# EasyEDA Pro project AC2024-欧标单相v1.2（使用立创EDA专业版）.epro, board AC2024-02
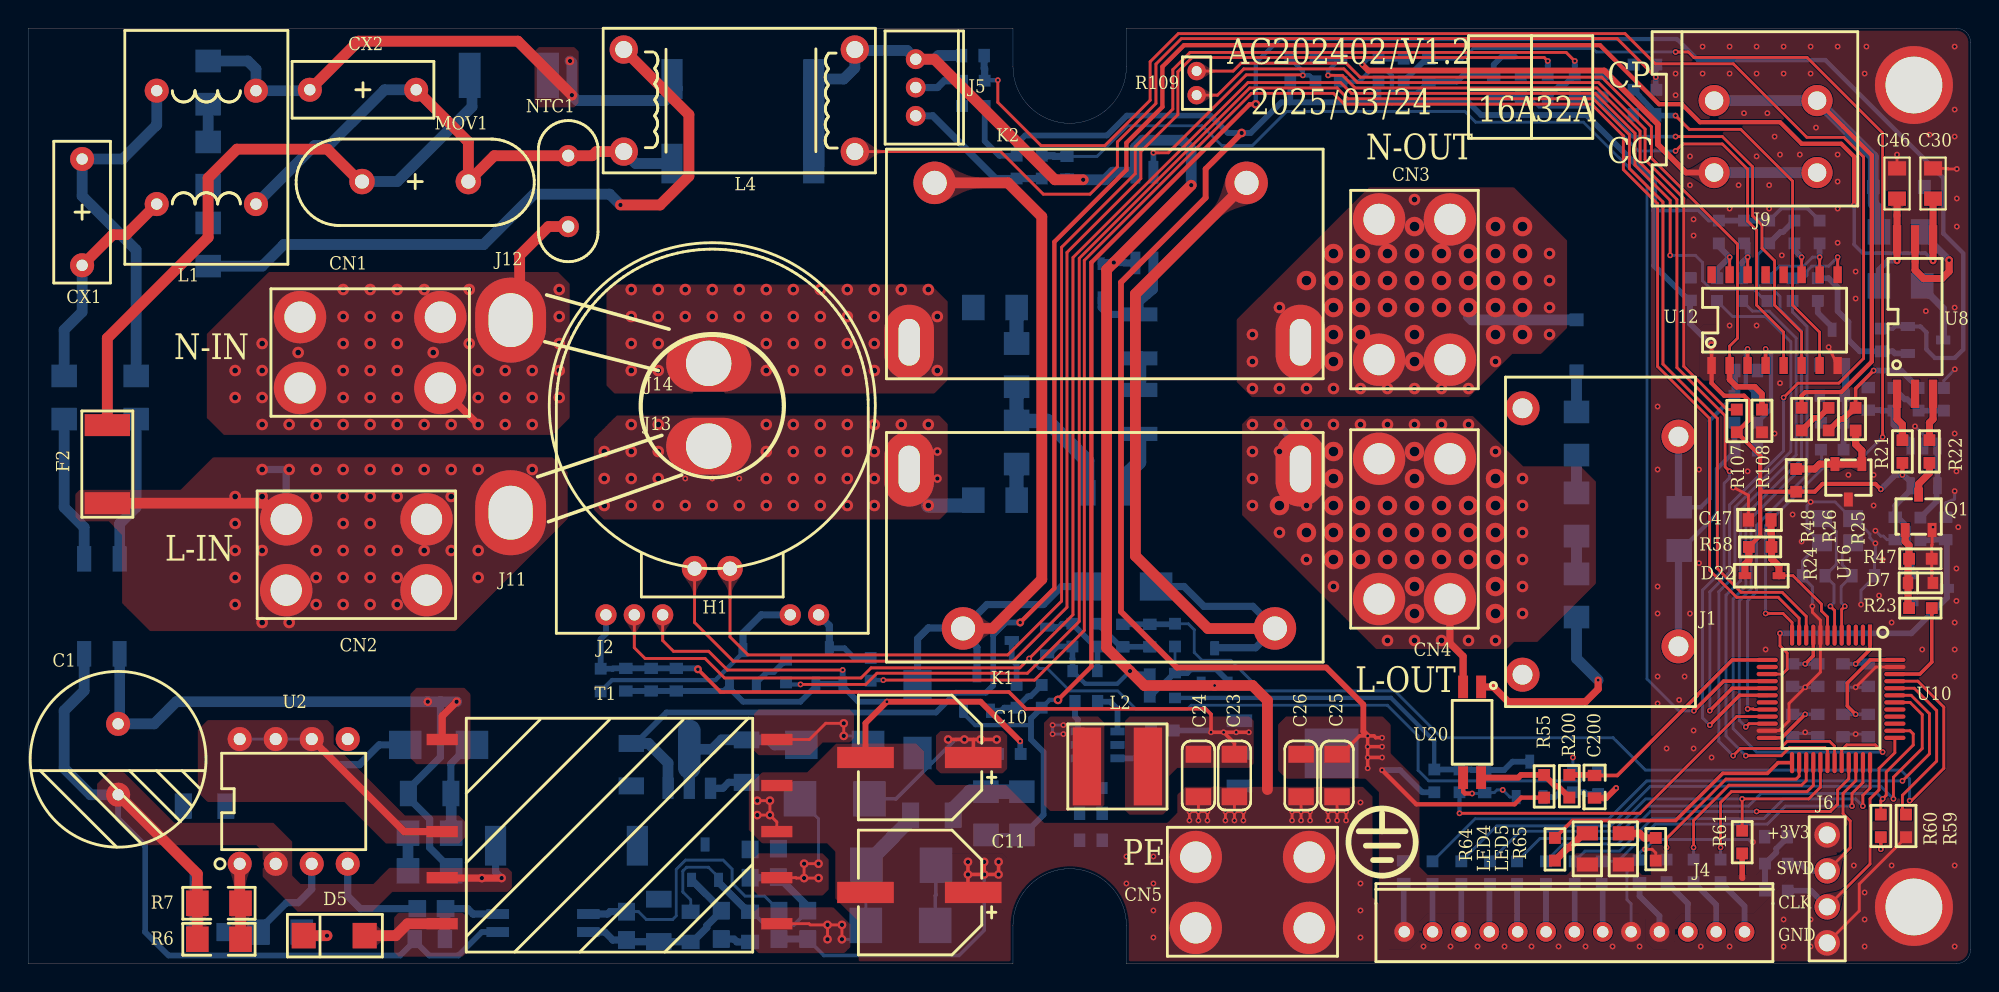
[diagram p7: board, top side]
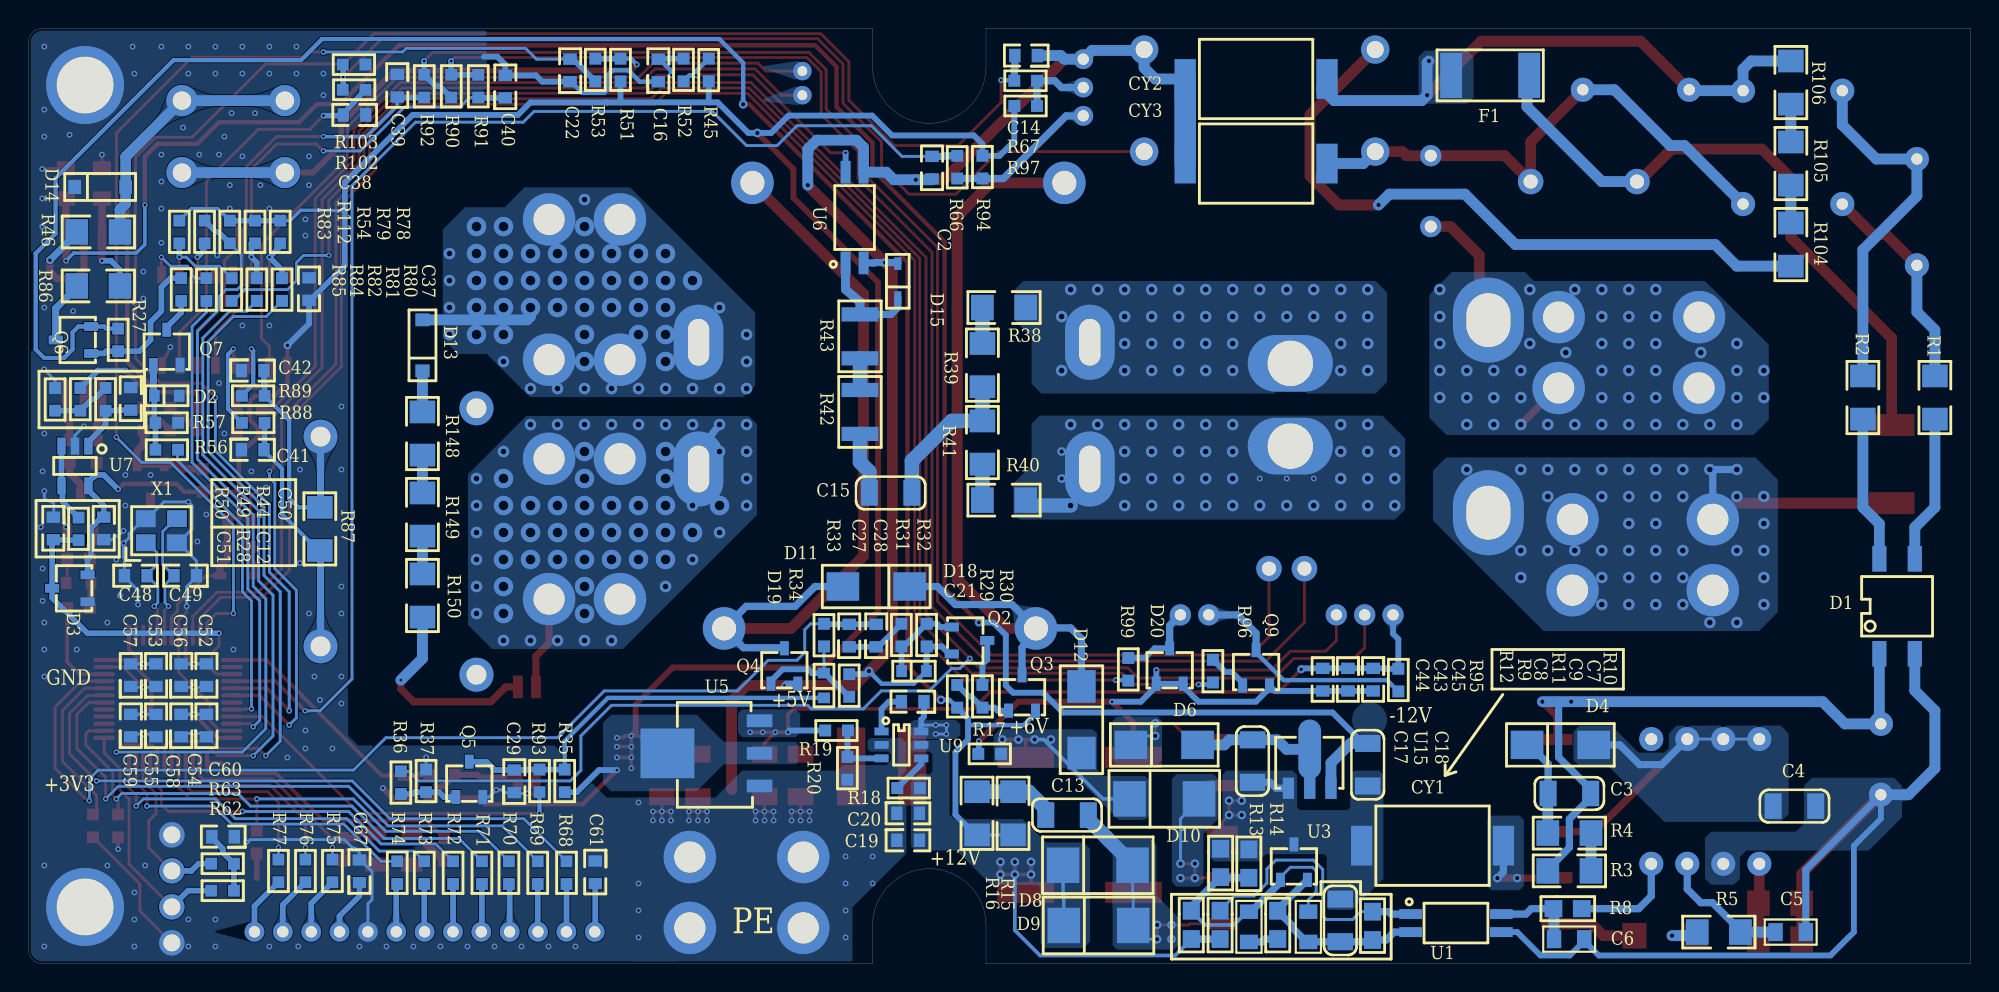
[diagram p8: board, bottom side, seen from below]

Outline 137 x 66 mm; copper layers: Top Layer, Bottom Layer. Coordinates in mm from the lower left corner of the outline.
Outline path: 0,66 0,0 69.45,0 69.45,2.7 arc(73.45,6.7) 77.45,2.7 77.45,0 136,0 arc(136.71,0.29) 137,1 137,65 arc(136.71,65.71) 136,66 77.45,66 77.45,63.3 arc(73.45,59.3) 69.45,63.3 69.45,66 0,66
Stack: Top Layer 0.0343mm / SUBSTRATE1 0.254mm er 4.3 / Bottom Layer 0.0343mm

## Design rules (mm)
spacing safeClearance (default): track to track 0.152, other pairs 0 to 0.254
spacing safeClearance1: track to track 2, other pairs 0 to 2
spacing safeClearance2: track to track 0.152, other pairs 0 to 0.152
spacing safeClearance3: track to track 0.254, other pairs 0 to 0.254
spacing safeClearance4: track to track 0.203, other pairs 0 to 0.254
track width trackWidth (default): min 0.152, default 0.203, max 5.08
track width trackWidth1: min 0.152, default 0.762, max 5.08
track width trackWidth2: min 0.152, default 0.508, max 5.08
track width trackWidth3: min 0.152, default 0.203, max 5.08
track width trackWidth4: min 0.152, default 0.254, max 5.08
differential pair differentialPair (default): width min 0.127, default 0.254, max 2.54; gap min 0.152, default 0.152
via viaSize (default): diameter min 0.5, default 0.61, max 10; hole min 0.3, default 0.305, max 6
net $$$23265 uses POR99140385
net +5V uses POR76334615
net $$$29133 uses POR74324617
net $$$25465 uses POR80075074
net +12V uses POR82536484
net +6V uses POR68774254
net AGND uses POR24477767
net $$$24219 uses POR72453578
net $$$6271 uses POR17870074
net $$$22503 uses POR37894306
net GND uses POR43455361
net +3V3 uses POR19795428
net L-IN2 uses POR56450083
net V+ uses POR25423456
net $$$22081 uses POR48997329
net $$$23262 uses POR41571345
net $$$12226 uses POR1077142
net -12V uses POR34067652
net N-OUT uses POR80925143
net $$$17797 uses POR43819538
net L-IN uses POR98761007
net $$$17793 uses POR41183665
net N-IN uses POR41419589
net L-OUT uses POR66909326
pour ie6310 uses POR77305320
pour ie6311 uses POR99140385
pour ie6312 uses POR42237262
pour ie6313 uses POR76334615
pour ie6314 uses POR23441365
pour ie6315 uses POR74324617
pour ie6316 uses POR28344334
pour ie6317 uses POR65403304
pour ie6318 uses POR77011558
pour ie6319 uses POR80075074
pour ie6320 uses POR77717735
pour ie6321 uses POR60842042
pour ie6322 uses POR30590647
pour ie6323 uses POR86555992
pour ie6324 uses POR82536484
pour ie6325 uses POR26768632
pour ie6326 uses POR75794220
pour ie6327 uses POR29333259
pour ie6328 uses POR54887547
pour ie6329 uses POR81080349
pour ie6330 uses POR83404065
pour ie6331 uses POR57536527
pour ie6332 uses POR56450083
pour ie6333 uses POR47109665
pour ie6334 uses POR43455361
pour ie6335 uses POR91392147
pour ie6336 uses POR24477767
pour ie6337 uses POR68774254
pour ie6338 uses POR69109533
pour ie6339 uses POR19795428
pour ie6340 uses POR25423456
pour ie6341 uses POR48997329
pour ie6342 uses POR37894306
pour ie6343 uses POR17870074
pour ie6344 uses POR72453578
pour ie6345 uses POR41571345
pour ie6346 uses POR1077142
pour ie6347 uses POR34067652
pour ie6348 uses POR49352428
pour ie6349 uses POR96451461
pour ie6350 uses POR65814
pour ie6351 uses POR78819734
pour ie6352 uses POR20858150
pour ie6353 uses POR41183665
pour ie6354 uses POR43819538
pour ie6355 uses POR98761007
pour ie6356 uses POR41419589
pour ie6357 uses POR80925143
pour ie6358 uses POR36935016
pour ie6359 uses POR66909326

## Placement (name value [footprint] x y rotation side)
C1  CAP-AE4  [C-P-5MM]  6.33 14.42 270 top
C2  100nF/25V/0603  [C0603]  73.26 56.97 270 bottom
C3  15pF/1kV/1206  [C1206]  28.3 12.01 180 bottom
C4  15pF/1kV/1206  [C1206]  12.43 11.12 0 bottom
C5  10uF/50V/0805  [C0805]  12.68 2.23 180 bottom
C6  1.5nF/50V/0805/NC  [C0805]  28.31 1.73 180 bottom
C7  1nF/2kV/1206  [C1206]  44.46 3.05 270 bottom
C8  100nF/50V/0805  [C0805]  50.91 2.61 90 bottom
C9  330pF/50V/0805  [C0805]  46.72 2.61 90 bottom
C10  470uF/16V  [SMD-C-D8XL10.5MM]  62.85 14.55 180 top
C11  330uF/25V  [SMD-C-D8XL10.5MM]  62.85 5.02 180 top
C12  100nF/25V/0603  [C0603]  131.68 29.92 90 bottom
C13  1nF/2kV/1206  [C1206]  63.74 10.48 180 bottom
C14  100nF/25V/0603  [C0603]  67.42 64.08 180 bottom
C15  15pF/1kV/1206  [C1206]  76.18 33.22 0 bottom
C16  100PF/25V/0603/NC  [C0603]  92.56 63.82 270 bottom
C17  10uF/50V/1206  [C1206]  50.65 14.29 90 bottom
C18  10uF/50V/1206  [C1206]  42.53 14.04 90 bottom
C19  10uF/25V/0603  [C0603]  74.15 8.71 0 bottom
C20  100nF/25V/0603  [C0603]  74.15 10.61 0 bottom
C21  100nF/25V/0603  [C0603]  75.42 18.49 180 bottom
C22  10nF/25V/0603  [C0603]  98.79 63.82 270 bottom
C23  47uF/10V/1206  [C1206]  85.07 13.28 90 top
C24  47uF/10V/1206  [C1206]  82.53 13.28 90 top
C25  47uF/10V/1206  [C1206]  92.31 13.28 90 top
C26  47uF/10V/1206  [C1206]  89.77 13.28 90 top
C27  4.7uF/25V/0603  [C0603]  79.1 23.95 270 bottom
C28  4.7uF/25V/0603  [C0603]  77.2 23.95 270 bottom
C29  100nF/25V/0603  [C0603]  102.72 13.66 270 bottom
C30  10uF/25V/0805  [C0805]  134.35 55.06 90 top
C37  100nF/25V/0603  [C0603]  117.2 46.81 90 bottom
C38  100nF/25V/0603  [C0603]  114.79 59.89 180 bottom
C39  33nF/25V/0603  [C0603]  110.98 61.16 90 bottom
C40  33nF/25V/0603  [C0603]  103.36 62.68 270 bottom
C41  33nF/25V/0603  [C0603]  120.38 36.27 0 bottom
C42  33nF/25V/0603  [C0603]  120.38 41.85 0 bottom
C43  10uF/25V/0603  [C0603]  43.92 19.25 90 bottom
C44  100nF/25V/0603  [C0603]  45.7 19.25 90 bottom
C45  1nF/25V/0603  [C0603]  42.15 19.25 90 bottom
C46  10uF/25V/0805  [C0805]  131.81 55.06 90 top
C47  100nF/25V/0603  [C0603]  122.92 31.31 180 top
C48  30pF/25V/0603  [C0603]  128.63 27.38 0 bottom
C49  30pF/25V/0603  [C0603]  126.73 27.38 180 bottom
C50  100PF/25V/0603  [C0603]  129.78 39.06 90 bottom
C51  100PF/25V/0603  [C0603]  135.24 29.92 90 bottom
C52  4.7uF/25V/0603  [C0603]  124.44 21.15 270 bottom
C53  4.7uF/25V/0603  [C0603]  128 21.15 270 bottom
C54  4.7uF/25V/0603  [C0603]  124.44 17.6 270 bottom
C55  4.7uF/25V/0603  [C0603]  128 17.6 270 bottom
C56  100nF/25V/0603  [C0603]  126.22 21.15 270 bottom
C57  100nF/25V/0603  [C0603]  129.78 21.15 270 bottom
C58  100nF/25V/0603  [C0603]  126.22 17.6 270 bottom
C59  100nF/25V/0603  [C0603]  129.78 17.6 270 bottom
C60  4.7uF/25V/0603  [C0603]  124.06 8.96 180 bottom
C61  4.7uF/25V/0603  [C0603]  97.01 5.66 90 bottom
C67  4.7uF/25V/0603  [C0603]  113.65 7.31 270 bottom
C200  10nF/25V/0603  [C0603]  110.47 13.28 270 top
CN1  YZ-9/5mmX9.9mm  [YZ-9]  24.11 43.12 0 top
CN2  YZ-9/5mmX9.9mm  [YZ-9]  23.14 28.85 0 top
CN3  YZ-9/5mmX9.9mm  [YZ-9]  97.77 47.57 90 top
CN4  YZ-9/5mmX9.9mm  [YZ-9]  97.77 30.68 90 top
CN5  ZY-65/5X8  [YZ-63/5X8]  86.34 5.02 0 top
CN7  CN  [4/5.5]  133 62.1 0 top
CN8  CN  [4/5.5]  133 4.1 0 top
CX1  0.1uF/350V  [DIP-X2-7.5MM]  3.79 53.03 270 top
CX2  0.1uF/350V  [DIP-X2-7.5MM]  23.6 61.67 180 top
CY1  TMY1222M  [SMD-Y1-5.4X7.8MM]  37.95 8.33 0 bottom
CY2  TMY1222M  [SMD-Y1-5.4X7.8MM]  50.4 62.43 180 bottom
CY3  TMY1222M  [SMD-Y1-5.4X7.8MM]  50.4 56.46 180 bottom
D1  MB10S  [MB10S-MBS]  5.19 25.22 90 bottom
D2  RB521S-30  [SOD-523]  127.24 40.08 180 bottom
D3  BAT54S  [SOT-23]  132.82 26.49 180 bottom
D4  US1M  [SMA-DO-214AC]  28.94 15.44 180 bottom
D5  D  [SMAF]  21.57 1.98 0 top
D6  SS2200  [SMA-DO-214AC]  56.88 15.44 180 bottom
D7  RB521S-30  [SOD-523]  133.46 26.87 0 top
D8  SS510B  [SMB-DO-214AA]  61.56 6.95 180 bottom
D9  SS510B  [SMB-DO-214AA]  61.52 2.7 180 bottom
D10  SS510B  [SMB-DO-214AA]  56.88 11.63 180 bottom
D11  US1D  [SMA-DO-214AC]  77.2 26.61 0 bottom
D12  SS14  [SMA-DO-214AC]  62.72 17.22 270 bottom
D13  RS1ML  [SOD-123FL-SMF14A]  109.2 43.63 90 bottom
D14  SMF14CA  [SOD-123FL-SMF14A]  131.93 54.81 180 bottom
D15  1N4148WS  [SOD-323]  75.67 47.95 90 bottom
D18  RB521S-30  [SOD-523]  74.53 20.64 180 bottom
D19  RB521S-30  [SOD-523]  80.88 19.63 90 bottom
D20  LMBZ5231BLT1G  [SOT-23]  56.5 19.76 270 bottom
D22  1N4148WS  [SOD-323]  122.03 27.38 0 top
F1  SST1200  [SMD-F-6.1X2.7MM]  33.89 62.68 0 bottom
F2  SST1500  [SMD-F-6.1X2.7MM]  5.57 35.25 90 top
H1  ZCT57-06N-02  [ZCT57-06N-02/2]  48.24 27.38 180 top
J1  -  [ZCT105-01]  105.39 20.39 90 top
J2  -  [MC003E1-A1]  48.24 39.31 0 top
J4  PH-1-2MM-13P  [1-2MM-13P]  97.05 2.25 0 top
J5  PH-1-2MM-3P  [DIP-1-2MM-3P]  62.59 63.82 270 top
J6  2.54mmX1X4P  [DIP-1-2.54MM-4P]  126.88 9.09 270 top
J9  KF142V  [KF142R]  122.54 58.36 90 top
J11  F10-10-6.5-0.4 Z  [3.1-3.8/5/6]  34.02 31.82 90 top
J12  F10-10-6.5-0.4 Z  [3.1-3.8/5/6]  34.02 45.41 90 top
J13  F10-10-6.5-0.4 Z  [3.2/4-6]  47.99 36.52 0 top
J14  F10-10-6.5-0.4 Z  [3.2/4-6]  47.99 42.36 0 top
K1  HF161  [HF161F-W/12-HT/2]  75.93 29.28 180 top
K2  HF161  [HF161F-W/12-HT/2]  75.93 49.47 0 top
L1  UU9.8-40mH  [UU9.8-40MH]  12.55 57.6 90 top
L2  4.7uH  [SMD/L/5X5MM]  76.82 13.91 0 top
L4  -  [ZMPT107-1]  50.15 60.9 180 top
LED4  翠绿  [LED0805]  109.96 8.2 270 top
LED5  翠绿  [LED0805]  112.5 8.2 270 top
MOV1  14D511K  [DIP-RV-7.5MM]  27.29 55.19 0 top
NTC1  22D-7  [NTC-22D-7-P=5MM]  38.08 52.01 90 top
Q1  2N7002LT1G  [SOT-23]  133.33 30.6 270 top
Q2  2N7002LT1G  [SOT-23]  71.86 22.8 0 bottom
Q3  AO3407(P)  [SOT-23]  66.91 17.85 270 bottom
Q4  2N7002LT1G  [SOT-23]  83.67 19.76 270 bottom
Q5  2N7002LT1G  [SOT-23]  105.9 11.75 270 bottom
Q6  AO3407(P)  [SOT-23]  132.57 44.01 180 bottom
Q7  2N7002LT1G  [SOT-23]  127.24 42.23 270 bottom
Q9  2N7002LT1G  [SOT-23]  50.4 19.63 270 bottom
R1  0R/1206  [R1206]  2.52 39.95 270 bottom
R2  0R/1206  [R1206]  7.6 39.95 270 bottom
R3  0R/1206  [R1206]  28.3 6.55 0 bottom
R4  0R/1206  [R1206]  28.3 9.21 180 bottom
R5  10R/1206  [R1206]  17.76 2.23 180 bottom
R6  1.5R/1206  [R1206]  13.44 1.72 0 top
R7  1.5R/1206  [R1206]  13.44 4.26 0 top
R8  0R/0805  [R0805]  28.43 3.88 0 bottom
R9  1.5K/0805  [R0805]  52.94 2.74 90 bottom
R10  1K  [R0805]  42.19 2.67 270 bottom
R11  10K/0805  [R0805]  48.88 2.74 90 bottom
R12  120K/0805  [R0805]  54.97 2.74 90 bottom
R13  510K/0805  [R0805]  52.91 7.11 90 bottom
R14  33K/0805  [R0805]  50.91 7.06 90 bottom
R15  20R/1206  [R1206]  67.55 10.61 270 bottom
R16  20R/1206  [R1206]  70.09 10.61 90 bottom
R17  10K/0603  [R0603]  69.2 14.8 180 bottom
R18  100K/0603  [R0603]  74.91 12.39 180 bottom
R19  150K/0603  [R0603]  79.99 16.45 0 bottom
R20  20K/0603  [R0603]  79.23 13.79 90 bottom
R21  200R/0603  [R0603]  132.19 36.14 90 top
R22  200R/0603  [R0603]  134.09 36.14 90 top
R23  1K/0603  [R0603]  133.46 25.09 180 top
R24  1K  [R0603]  124.7 34.11 90 top
R25  13K/0603  [R0603]  128.89 38.42 90 top
R26  75K/0603  [R0603]  126.98 38.42 90 top
R27  3.3K/0603  [R0603]  130.66 44.01 90 bottom
R28  1K/0603  [R0603]  133.46 30.68 90 bottom
R29  3.3K/0603  [R0603]  71.48 18.87 270 bottom
R30  4.7K/0603  [R0603]  69.7 18.87 270 bottom
R31  10K/0603  [R0603]  75.42 23.18 90 bottom
R32  100K/0603  [R0603]  73.64 23.18 90 bottom
R33  1K/0603  [R0603]  80.88 23.18 270 bottom
R34  10K/0603  [R0603]  79.1 19.63 270 bottom
R35  1K/0603  [R0603]  99.17 12.9 270 bottom
R36  1K/0603  [R0603]  110.73 12.77 90 bottom
R37  10K/0603  [R0603]  108.95 12.9 270 bottom
R38  499K/1206  [R1206]  68.18 46.3 0 bottom
R39  499K/1206  [R1206]  69.7 42.23 270 bottom
R40  499K/1206  [R1206]  68.18 32.71 0 bottom
R41  499K/1206  [R1206]  69.7 36.77 90 bottom
R42  499K/1210  [R1210]  78.34 38.93 90 bottom
R43  499K/1210  [R1210]  78.34 44.27 90 bottom
R44  1K/0603  [R0603]  131.55 39.82 90 bottom
R45  1K  [R0603]  89.01 63.06 270 bottom
R46  1K/1206  [R1206]  132.06 51.63 180 bottom
R47  10K/0603  [R0603]  133.46 28.57 180 top
R48  75K/0603  [R0603]  125.08 38.42 90 top
R49  1K/0603  [R0603]  133.33 39.82 90 bottom
R50  100K/0603  [R0603]  135.11 39.82 270 bottom
R51  10K/0603  [R0603]  95.23 63.06 90 bottom
R52  1K/0603  [R0603]  90.79 63.06 90 bottom
R53  10K/0603  [R0603]  97.01 63.06 90 bottom
R54  1K  [R0603]  122.79 51.63 90 bottom
R55  1K  [R0603]  106.92 12.52 270 top
R56  10K/0603  [R0603]  127.24 36.27 180 bottom
R57  100K/0603  [R0603]  127.24 38.17 0 bottom
R58  10K/0603  [R0603]  122.16 29.41 180 top
R59  10K/0603  [R0603]  132.44 9.72 270 top
R60  1K  [R0603]  130.66 9.72 270 top
R61  1K  [R0603]  120.89 8.58 270 top
R62  1K  [R0603]  123.3 5.15 180 bottom
R63  1K  [R0603]  123.3 7.06 180 bottom
R64  1K  [R0603]  107.68 8.07 270 top
R65  1K  [R0603]  114.79 8.07 90 top
R66  1K/0603  [R0603]  71.48 56.2 270 bottom
R67  1K/0603  [R0603]  66.66 62.3 0 bottom
R68  10R/0603  [R0603]  99.04 6.42 270 bottom
R69  10R/0603  [R0603]  101.07 6.42 270 bottom
R70  1uH/0603  [R0603]  103.11 6.42 270 bottom
R71  1uH/0603  [R0603]  105.01 6.42 270 bottom
R72  10R/0603  [R0603]  107.04 6.42 270 bottom
R73  1uH/0603  [R0603]  109.07 6.42 270 bottom
R74  1uH/0603  [R0603]  110.98 6.42 270 bottom
R75  10R/0603  [R0603]  115.55 6.55 270 bottom
R76  10R/0603  [R0603]  117.46 6.55 270 bottom
R77  10R/0603  [R0603]  119.36 6.55 270 bottom
R78  1K  [R0603]  119.23 51.63 90 bottom
R79  1K  [R0603]  121.01 51.63 90 bottom
R80  0R/0603  [R0603]  119.11 47.57 270 bottom
R81  0R/0603  [R0603]  120.89 47.57 270 bottom
R82  0R/0603  [R0603]  122.66 47.57 270 bottom
R83  1K  [R0603]  126.35 51.63 90 bottom
R84  0R/0603  [R0603]  124.44 47.57 270 bottom
R85  4.7K/0603  [R0603]  126.22 47.57 90 bottom
R86  0R/1206  [R1206]  132.06 47.82 0 bottom
R87  0.8R/1206  [R1206]  116.44 30.68 90 bottom
R88  1K/0603  [R0603]  121.14 38.17 180 bottom
R89  1K/0603  [R0603]  121.14 40.08 0 bottom
R90  360R/0603  [R0603]  107.17 61.92 270 bottom
R91  1K/0603  [R0603]  105.26 61.92 270 bottom
R92  1K/0603  [R0603]  109.07 61.92 270 bottom
R93  1K/0603  [R0603]  100.95 12.9 270 bottom
R94  1K  [R0603]  69.7 56.2 90 bottom
R95  10K/0603  [R0603]  40.37 20.01 90 bottom
R96  4.7K/0603  [R0603]  53.45 20.64 270 bottom
R97  1K  [R0603]  66.66 60.52 0 bottom
R99  1K/0603  [R0603]  59.42 20.77 270 bottom
R102  1K/0603  [R0603]  114.03 61.67 180 bottom
R103  24R/0603  [R0603]  114.03 63.44 0 bottom
R104  36K/1206  [R1206]  12.68 50.74 270 bottom
R105  36K/1206  [R1206]  12.68 56.46 90 bottom
R106  36K/1206  [R1206]  12.68 62.17 90 bottom
R107  10K/0603  [R0603]  120.5 38.3 270 top
R108  10K/0603  [R0603]  122.28 38.3 90 top
R109  MF52A103F3950 (A1)  [MF52A103F3950-NTC-2P]  82.4 61.28 270 top
R112  0R/0603  [R0603]  124.57 51.63 90 bottom
R148  7.5K/1206  [R1206]  109.2 37.41 270 bottom
R149  7.5K/1206  [R1206]  109.2 31.69 270 bottom
R150  7.5K/1206  [R1206]  109.2 25.98 270 bottom
R200  1K/0603  [R0603]  108.69 12.52 90 top
T1  T-10  [EE16-4-5]  29.19 15.82 0 top
U1  EL3H7(A)(TA)-G  [SSOP-4]  36.3 2.86 180 bottom
U2  OB5102P  [DIP8-2]  18.72 11.45 90 top
U3  AZ431AN-ATRE1  [SOT-23]  47.73 5.91 270 bottom
U5  AH1117CLTR33  [SOT-223-3]  85.42 14.84 180 bottom
U6  EL3H7(A)(TA)-G  [SSOP-4]  78.72 52.65 90 bottom
U7  LMV321IDBVR  [SOT-23-5]  133.71 35.12 270 bottom
U8  CA-IS3211VBJ  [SOIC-6]  133.08 45.66 90 top
U9  WD5018  [SOT23-6]  75.42 15.44 180 bottom
U10  GD32F130C8T6/LQFP-48  [LQFP-48]  129.9 23.18 180 top
U12  BL0939  [SOP16L_BL0939]  123.17 45.41 90 top
U15  CJ79L12  [SOT-89]  46.62 12.38 270 bottom
U16  AZ431AN-ATRE1  [SOT-23]  128.38 35.25 90 top
U20  EL3H7(A)(TA)-G  [SSOP-4]  101.84 16.33 270 top
X1  SMD3225-4P-8M  [SMD3225-4P]  127.62 30.55 180 bottom

## Footprints (pads in the part's own frame, mm; a bottom-side part is the same pattern mirrored in y, then rotated)
1-2MM-13P
  round 1.4 hole 0.8: 1(0,0) 2(2,0) 3(4,0) 4(6,0) 5(8,0) 6(10,0) 7(12,0) 8(14,0) 9(16,0) 10(18,0) 11(20,0) 12(22,0) 13(24,0)
3.1-3.8/5/6
  oval 6x5 hole 3.8x3.1: 1(0,0)
3.2/4-6
  oval 6x4 hole 3.2: 1(0,0)
4/5.5
  round 5.5 hole 4: 1(0,-0.1)
C0603
  rect 0.8x0.955 smd: 1(0,0) 2(1.59,0)
C0805
  rect 1.016x1.27 smd: 1(-1.078,-0.002) 2(1.056,-0.002)
C1206
  rect 1.2x1.8 smd: 1(1.5,0) 2(-1.5,0)
C-P-5MM
  round 1.7 hole 0.8: 1(-2.5,0) 2(2.5,0)
DIP8-2
  round 1.7 hole 0.85: 1(-4.4,3.81) 2(-4.4,1.27) 3(-4.4,-1.27) 4(-4.4,-3.81) 5(4.4,-3.81) 6(4.4,-1.27) 7(4.4,1.27) 8(4.4,3.81)
DIP-1-2.54MM-4P
  round 1.8 hole 1.2: 1(0,0) 2(2.54,0) 3(5.08,0) 4(7.62,0)
DIP-1-2MM-3P
  round 1.4 hole 0.8: 1(0,0) 2(2,0) 3(4,0)
DIP-RV-7.5MM
  round 1.8 hole 1: 1(-3.75,0) 2(3.75,0)
DIP-X2-7.5MM
  round 1.7 hole 0.8: 1(-3.75,0) 2(3.75,0)
EE16-4-5
  rect 2.2x0.8 smd: 1(0,0) 3(0,-6.5) 4(0,-9.75) 5(0,-13) 6(23.6,-13) 7(23.6,-9.75) 8(23.6,-6.5) 9(23.6,-3.25) 10(23.6,0)
HF161F-W/12-HT/2
  round 3 hole 1.7: 1(-12,5.625) 2(10,5.625)
  oval 3.5x5.3 hole 1.5x3.3: 3(13.8,-5.625) 4(-13.8,-5.625)
KF142R
  round 2.2 hole 1.3: 1(-2.54,3.63) 2(2.54,3.63) 3(2.54,-3.63) 4(-2.54,-3.63)
LED0805
  rect 1x1.5 smd: 1(-1,0) 2(1.2,0)
LQFP-48
  rect 0.3x1.5 smd: 1(0,0)
  oval 0.3x1.5 smd: 2(0.5,0) 3(1,0) 4(1.5,0) 5(2,0) 6(2.5,0) 7(3,0) 8(3.5,0) 9(4,0) 10(4.5,0) 11(5,0) 12(5.5,0) 25(5.5,9) 26(5,9) 27(4.5,9) 28(4,9) 29(3.5,9) 30(3,9) 31(2.5,9) 32(2,9) 33(1.5,9) 34(1,9) 35(0.5,9) 36(0,9)
  oval 1.5x0.3 smd: 13(7.25,1.75) 14(7.25,2.25) 15(7.25,2.75) 16(7.25,3.25) 17(7.25,3.75) 18(7.25,4.25) 19(7.25,4.75) 20(7.25,5.25) 21(7.25,5.75) 22(7.25,6.25) 23(7.25,6.75) 24(7.25,7.25) 37(-1.75,7.25) 38(-1.75,6.75) 39(-1.75,6.25) 40(-1.75,5.75) 41(-1.75,5.25) 42(-1.75,4.75) 43(-1.75,4.25) 44(-1.75,3.75) 45(-1.75,3.25) 46(-1.75,2.75) 47(-1.75,2.25) 48(-1.75,1.75)
MB10S-MBS
  rect 1.8x1 smd: 1(-3.35,1.25) 2(-3.35,-1.25) 3(3.35,-1.25) 4(3.35,1.25)
MC003E1-A1
  round 1.5 hole 0.8: 1(-7.5,-14.7) 2(-5.5,-14.7) 3(-3.5,-14.7) 4(5.5,-14.7) 5(7.5,-14.7)
MF52A103F3950-NTC-2P
  round 1.3 hole 0.7: 1(-1.7,0) 2(0,0)
NTC-22D-7-P=5MM
  round 1.5 hole 0.85: 1(0,0) 2(5,0)
R0603
  rect 0.838x0.838 smd: 1(-0.8,0) 2(0.8,0)
R0805
  rect 1.25x1.2 smd: 1(1,0) 2(-1,0)
R1206
  rect 1.6x1.8 smd: 1(-1.524,0) 2(1.524,0)
R1210
  rect 1x2.6 smd: 1(-1.55,0) 2(1.55,0)
SMA-DO-214AC
  rect 2.3x2 smd: 1(-2.35,0) 2(2.35,0)
SMAF
  rect 1.7x1.8 smd: 1(-2.15,0) 2(2.15,0)
SMB-DO-214AA
  rect 2.3x2.5 smd: 1(-2.45,0) 2(2.45,0)
SMD3225-4P
  rect 1.4x1.2 smd: 1(-1.1,-0.85) 2(1.1,-0.85) 3(1.1,0.85) 4(-1.1,0.85)
SMD-C-D8XL10.5MM
  rect 4x1.5 smd: 1(-3.8,0) 2(3.8,0)
SMD-F-6.1X2.7MM
  rect 1.55x3.2 smd: 1(-2.755,0) 2(2.755,0)
SMD-Y1-5.4X7.8MM
  rect 1.5x2.8 smd: 1(-5,0) 2(5,0)
SMD/L/5X5MM
  rect 2x5.5 smd: 1(-2.15,0) 2(2.15,0)
SOD-123FL-SMF14A
  rect 0.9x1 smd: 1(-1.8,0) 2(1.8,0)
SOD-323
  rect 0.9x0.5 smd: 1(-0.95,0) 2(1.45,0)
SOD-523
  rect 0.75x0.85 smd: 1(-0.875,0) 2(0.875,0)
SOIC-6
  rect 2x0.6 smd: 1(-5.45,1.27) 2(-5.45,0) 3(-5.45,-1.27) 4(5.45,-1.27) 5(5.45,0) 6(5.45,1.27)
SOP16L_BL0939
  rect 1.2x0.6 smd: 1(-3.2,4.445) 2(-3.2,3.175) 3(-3.2,1.905) 4(-3.2,0.635) 5(-3.2,-0.635) 6(-3.2,-1.905) 7(-3.2,-3.175) 8(-3.2,-4.445) 9(3.2,-4.445) 10(3.2,-3.175) 11(3.2,-1.905) 12(3.2,-0.635) 13(3.2,0.635) 14(3.2,1.905) 15(3.2,3.175) 16(3.2,4.445)
SOT23-6
  rect 1x0.55 smd: 1(-1.4,0.95) 2(-1.4,0) 3(-1.4,-0.95) 4(1.4,-0.95) 5(1.4,0) 6(1.4,0.95)
SOT-23
  rect 1x0.63 smd: 1(0,-0.95) 2(0,0.95) 3(-2.5,0)
SOT-23-5
  rect 1.2x0.6 smd: 1(-1.4,0.95) 2(-1.4,0) 3(-1.4,-0.95) 4(1.4,-0.95) 5(1.4,0.95)
SOT-89
  rect 1.5x0.8 smd: 1(0,-1.5) 2(0,0) 3(0,1.5)
  oval 4.2x1.6 smd: 4(-2.75,0)
SOT-223-3
  rect 1.8x0.9 smd: 1(0,-2.3) 2(0,0) 3(0,2.3)
  rect 3.8x3.5 smd: 4(-6.5,0)
SSOP-4
  rect 1.6x0.7 smd: 1(-3.2,0.635) 2(-3.2,-0.635) 3(3.2,-0.635) 4(3.2,0.635)
UU9.8-40MH
  round 1.7 hole 0.8: 1(-4,3.5) 2(-4,-3.5) 3(4,-3.5) 4(4,3.5)
YZ-9
  round 3.7 hole 2.2: 1(-4.95,2.5) 2(-4.95,-2.5) 3(4.95,-2.5) 4(4.95,2.5)
YZ-63/5X8
  round 3.7 hole 2.2: 1(-4,2.5) 2(-4,-2.5) 3(4,-2.5) 4(4,2.5)
ZCT57-06N-02/2
  round 1.8 hole 1: 1(1.25,-0.5) 2(-1.25,-0.5)
ZCT105-01
  round 2.4 hole 1.4: 1(2,-11) 2(16.8,-11) 3(18.8,0) 4(0,0)
ZMPT107-1
  round 2 hole 1.2: 1(-8.15,3.6) 2(-8.15,-3.6) 3(8.15,-3.6) 4(8.15,3.6)

## Nets
As in the schematic, except:
GND: C2.2 C7.2 C10.2 C11.2 C12.1 C14.2 C16.2 C17.2 C18.2 C19.2 C20.2 C22.2 C23.2 C24.2 C25.2 C26.2 C29.2 C30.2 C37.2 C38.2 C39.2 C40.1 C41.2 C42.2 C43.1 C44.1 C45.1 C46.2 C47.2 C48.2 C49.2 C50.2 C51.2 C52.2 C53.2 C54.2 C55.2 C56.2 C57.2 C58.2 C59.2 C60.2 C61.2 C67.1 C200.2 CN5.1 CN5.2 CN5.3 CN5.4 CN7.1 CN8.1 CY1.2 CY2.1 CY3.1 D2.2 D3.1 D7.2 D14.1 D15.2 D18.2 D20.1 D20.2 J2.3 J4.9 J5.1 J6.4 L4.2 Q1.2 Q2.2 Q4.2 Q5.2 Q7.2 Q9.2 R13.1 R14.1 R17.1 R20.1 R32.1 R34.1 R37.1 R47.1 R50.1 R57.1 R59.2 R65.1 R103.1 R108.1 T1.8 T1.9 U3.3 U5.1 U6.2 U6.3 U7.2 U9.2 U10.8 U10.23 U10.47 U12.8 U15.1 U16.3 U20.3 X1.2 X1.4
$$$9261: C17.1 D6.2 U15.2 U15.4
$$$10461: D14.2 J9.2 J9.3 R46.2 R48.2
$$$28729: J9.1 J9.4 R51.2 R53.2
L-IN: CN2.1 CN2.2 CN2.3 CN2.4 F2.1 J11.1
L-OUT: CN4.1 CN4.2 CN4.3 CN4.4 K1.4 U20.2
N-IN: CN1.1 CN1.2 CN1.3 CN1.4 J12.1 NTC1.1
N-OUT: CN3.1 CN3.2 CN3.3 CN3.4 D13.2 K2.3

Pads without a net: J1 3 4; U2 5; U8 2; U10 2 3 4 14 19 39 40 41; U12 12 13 16

## Via types
v1: diameter 0.559, hole 0.254, Top Layer to Bottom Layer, 4 vias
v2: diameter 0.406, hole 0.203, Top Layer to Bottom Layer, 247 vias
v3: diameter 0.61, hole 0.305, Top Layer to Bottom Layer, 41 vias
v4: diameter 1.371, hole 0.686, Top Layer to Bottom Layer, 67 vias
v5: diameter 0.813, hole 0.406, Top Layer to Bottom Layer, 211 vias

## Routing (per net, layer and track width the routed paths; a pad name or vN(x,y) marks a point on that pad's centre or on a via; arc(x,y) is an arc through that point)
+3V3: length 245.6
  Top Layer w0.254: v2(94.47,16.07) 93.9,16.07 92.61,14.78 C25.1 ; v2(94.47,16.07) v2(94.47,15.31) ; v2(94.47,16.07) 94.91,16.07 95.04,15.95 v2(95.49,15.95) ; v2(94.47,15.31) v2(95.49,15.31) ; v2(94.47,15.31) v2(94.47,14.55) ; v2(128.89,21.15) 129.9,22.17 U10.1 ; U12.1 v1(118.73,43.63) ; v2(125.33,21.15) 125.9,21.72 U10.9 ; v2(94.47,14.55) v2(95.49,14.55) ; v2(94.47,14.55) v2(94.47,13.79) ; U10.48 129.93,21.43 128.3,19.81 128.3,18.18 v2(128.89,17.6) ; v2(125.33,17.6) 123.67,15.93 U10.24 ; 130.66,8.92 v2(130.66,8.07) ; D22.1 121.28,27.38
  Top Layer w0.305: 122.16,33.47 122.16,30.21 R58.2 ; 122.16,33.47 122.16,35.85 R107.2 121.39,38.39 121.39,39.69 121.01,40.08 119.62,40.08 118.73,40.96 U12.1 ; 122.16,33.47 122.16,33.31 R24.1 126,33.31 126.55,33.85 130.28,33.85 v2(130.66,33.47) ; v2(95.49,13.66) 97.9,11.25 104.83,11.25 105.3,11.72 R55.2 ; v2(132.19,34.49) R21.1
  Top Layer w0.406: 120.9,6.04 120.89,6.06 R61.2 ; v2(94.47,16.07) 94.16,16.38 94.16,18.28 91.55,20.9 81.01,20.9 77.07,24.84 77.07,48.08 83.04,54.05 83.04,56.08 v3(85.58,58.62)
  Top Layer w0.508: D22.1 121.08,28.17 121.36,28.45 R58.2
  Bottom Layer w0.254: C54.1 v2(125.33,17.6) C58.1 ; C53.1 v2(128.89,21.15) C57.1 ; R83.2 125.5,53.28 123.64,53.28 R54.2 ; U7.5 132.76,34.07 ; R78.2 118.53,52.43 117.81,53.16 116.42,53.16 116.4,53.14 114.68,53.14 ; C55.1 v2(128.89,17.6) C59.1 ; C52.1 v2(125.33,21.15) C56.1
  Bottom Layer w0.406: R97.2 67.46,58.04 68.5,57 R94.2 69.7,57.84 70.3,58.44 76.08,58.44 77.48,59.84 83.38,59.84 84.61,58.62 v3(85.58,58.62) 86.21,58.62 88.37,60.78 88.98,60.78 ; R45.2 89.01,60.8 88.98,60.78 ; 88.98,60.78 95.18,60.78 ; R78.2 R79.2 R54.2 ; C61.1 97.01,2.29 J4.1 ; R35.2 98.32,12.1 96.76,13.66 v2(95.49,13.66) ; v1(118.73,43.63) 117.2,45.16 C37.1 117.12,46.81 114.68,49.25 114.68,55.11 109.9,59.89 102.47,59.89 101.58,60.78 96.18,60.78 96.18,60.77 96.17,60.78 95.18,60.78 ; 95.18,60.78 95.23,60.83 R51.1 ; C67.2 113.65,4.77 115.05,3.36 J4.10 ; C60.1 124.06,8.88 123.29,8.11 123.29,7.85 R63.2 R62.2 ; v2(130.66,33.47) 131.68,34.49 v2(132.19,34.49) 132.76,34.07 U7.5 132.76,33.41 131.68,32.33 C12.2 131.84,31.51 132.57,30.78 132.57,28.77 132.82,28.52 132.82,27.44
+5V: length 56.9
  Top Layer w0.254: v2(84.31,16.33) 85.07,15.56 C23.1 ; v2(84.31,16.33) v2(83.42,16.33) 83.42,17.6 83.04,17.98 70.36,17.98 69.17,19.17 48.83,19.17 v1(47.23,20.77) ; v2(84.31,16.33) v2(85.2,16.33) v2(86.09,16.33)
  Bottom Layer w0.406: R19.2 83.29,16.45 v2(83.42,16.33) ; v1(47.23,20.77) 47.23,20.84 C44.2 C43.2 C45.2 41.24,20.84 41.21,20.81 R95.2 40.37,22.9 40.74,23.28 J2.1
+6V: length 13.1
  Top Layer w0.254: v3(68.31,15.82) v3(67.16,15.82) 66.66,15.82 ; 66.65,14.55 66.66,14.55 66.66,15.82 ; v3(64.88,15.82) v3(66.02,15.82) 66.66,15.82
  Bottom Layer w0.254: D10.1 61.2,11.63 65.39,15.82 v3(66.02,15.82)
+12V: length 174.7
  Top Layer w0.254: v3(67.42,6.29) v3(68.43,6.29) v3(68.43,7.18) ; v3(67.42,6.29) v3(67.42,7.18) ; v3(67.42,6.29) v3(66.28,6.29) ; 66.65,5.02 66.28,5.02 v3(66.28,6.29) ; v3(66.28,6.29) v3(66.28,7.18)
  Top Layer w0.305: v3(86.58,60.64) 86.15,60.64 74.98,49.48 74.98,20.97 v3(72.63,18.61)
  Bottom Layer w0.254: D8.1 64.02,4.84 63.97,4.8 D9.1 ; R12.2 54.97,1.71 56.11,0.58 65.64,0.58 67.42,2.36 v3(67.42,6.29) ; R16.1 R15.2
  Bottom Layer w0.305: v3(86.58,60.64) 86.58,63.57 88.26,65.24 116.28,65.24 117.76,63.76 126.75,63.76 135.08,55.43 135.08,51.52 136.48,50.12 136.48,43.34 135.88,42.74 134.48,42.74 133.88,43.34 133.88,44.54 133.46,44.96 Q6.2 131.65,44.96 131.5,44.81 R27.2 ; 70.72,16.71 70.59,16.83 66.79,16.83 65.96,17.67 Q3.2 ; v3(72.63,18.61) 72.03,18.61 R29.2
  Bottom Layer w0.406: R29.2 70.72,17.3 70.72,15.82 71.61,14.93 71.61,10.51 70.19,9.09 R16.1
  Bottom Layer w0.508: R12.2 R9.2
-12V: length 150.7
  Top Layer w0.305: v1(69.96,24.07) 72.37,26.49 72.37,50.93 77.45,56.01 77.45,57.92 79.99,60.46 79.99,63.29 81.52,64.81 110.85,64.81 115.02,60.65 116.63,60.65 117.9,59.38 123.55,59.38 125.08,57.86 127.87,57.86 128.78,56.94 v2(128.78,53.54)
  Top Layer w0.508: 134.35,53.98 U8.4 v2(134.35,49.6)
  Bottom Layer w0.254: v2(134.35,49.6) 133.8,50.14 129.38,50.14 128.78,50.74 v2(128.78,53.54)
  Bottom Layer w0.406: v1(69.96,24.07) 68.94,24.07 68.05,23.18 68.05,19.63 67.55,19.12 65.42,19.12 64.02,17.72 45.01,17.72 42.83,15.54 C18.1
  Bottom Layer w0.762: C18.1 43.75,15.54 45.12,14.17 U15.3
AGND: length 82.2
  Top Layer w0.508: v3(33.38,6.04) v3(31.99,6.04) 29.19,6.04 T1.4
  Top Layer w0.762: C1.2 11.92,6.33 R7.1 R6.1
  Bottom Layer w0.406: 27.25,1.6 28.28,0.58 30.33,0.58 31.99,2.23 U1.3 ; 27.25,1.6 26.23,0.58 9.89,0.58 8.24,2.23 8.24,8.33 6.33,10.23 C1.2 ; 27.25,1.6 C6.2
  Bottom Layer w0.508: C6.2 27.25,1.6 ; C5.2 11.63,6.63 C1.2 ; v3(33.38,6.04) 32.95,6.47 CY1.1
  Bottom Layer w0.762: D1.2 3.94,19.27 2.52,17.85 2.52,13.79 4.39,11.92 C1.2
GND: length 301.6
  Top Layer w0.152: C47.2 121.39,31.31
  Top Layer w0.203: 92.31,11.78 v2(92.31,10.74) ; v2(92.31,10.74) v2(91.68,10.74) v2(91.68,10.1) ; v2(92.31,10.74) v2(92.95,10.74) v2(92.95,10.1) ; v2(92.31,10.74) v2(92.31,10.1) ; 132.44,8.92 129.14,5.62 129.14,3.73 J6.4 ; v2(81.9,10.1) v2(81.9,10.74) v2(82.53,10.74) ; 121.39,31.31 C47.2 121.33,33.05 120.25,33.62 v2(120.25,33.6) ; C30.2 135.37,56.12 135.41,56.08 v2(136.02,56.08) ; 85.07,11.78 v2(85.07,10.74) ; v2(85.07,10.74) v2(85.71,10.74) v2(85.71,10.1) ; v2(85.07,10.74) v2(85.07,10.1) ; v2(85.07,10.74) v2(84.44,10.74) v2(84.44,10.1) ; D7.2 134.35,26.88 134.35,26.91 134.26,26.99 134.26,29.53 134.28,29.56 Q1.2 v2(134.35,30.8) ; v2(89.14,10.1) v2(89.14,10.74) v2(89.77,10.74) ; v2(114.03,8.07) 114.54,8.07 114.79,7.82 R65.1 ; U10.23 122.65,16.45 123.5,16.45 124.19,17.14 124.19,18.36 v2(125.33,19.5) 126.4,20.57 U10.8 126.4,24.24 125.84,24.8 v2(125.84,25.22) ; v2(89.77,10.74) v2(89.77,10.1) ; v2(89.77,10.74) v2(90.41,10.74) v2(90.41,10.1) ; v2(89.77,10.74) 89.77,11.78 ; v2(57.44,20.72) 49.31,20.72 47.99,22.04 45.5,22.04 44.74,22.8 J2.3 ; v2(82.53,10.74) v2(83.17,10.74) v2(83.17,10.1) ; v2(82.53,10.74) 82.53,11.78 ; v2(82.53,10.74) v2(82.53,10.1) ; U10.47 130.32,20.93 v2(128.89,19.5) ; v3(52.31,10.48) v3(51.42,10.48) ; v3(52.31,10.48) v3(52.31,11.5) v3(51.42,11.5) ; v3(52.31,10.48) 52.79,10 T1.8 ; 131.81,56.12 v2(131.81,57.09) ; U12.8 v2(126.98,43.5)
  Top Layer w0.305: U20.3 101.2,12.14 101.33,12.01 v2(101.84,12.01)
  Top Layer w0.406: v2(69.96,15.69) 67.16,18.49 v2(60.56,18.49) 59.05,16.97 C10.2 ; C200.2 111.29,11.69 v2(112,12.39)
  Top Layer w0.762: 87.4,12.29 87.4,18.57 86.34,19.63 v2(83.67,19.63) 78.72,19.63 v3(77.71,20.64) 76.05,22.3 76.05,48.97 v3(76.56,49.47) v3(82.02,54.93) ; J5.1 63.9,63.82 72.41,55.32 v3(74.4,55.32)
  Bottom Layer w0.203: R50.1 135.11,41.14 v2(135.88,41.94) ; v2(125.84,25.22) 125.84,26.6 125.14,27.3 C49.2 125.14,28.42 126.42,29.7 ; 125.33,16.24 v2(125.33,16.33) ; 125.33,16.24 126.22,16.24 C58.2 ; 125.33,16.24 124.44,16.24 C54.2 ; C59.2 129.78,16.2 v2(128.89,16.2) 128,16.2 C55.2 ; C53.2 128,19.5 v2(128.89,19.5) 129.78,19.5 C57.2 ; C56.2 126.22,19.5 v2(125.33,19.5) 124.44,19.5 C52.2 ; J4.9 113.05,4.22 112.76,4.52 112.76,6.5 113.57,7.31 C67.1 113.65,7.81 113.97,8.13 v2(114.03,8.07) 114.71,8.76 121.34,8.76 121.58,8.52 v2(121.65,8.58) ; 126.42,29.7 125.46,30.66 125.46,32.33 v2(125.71,32.58) 127.43,32.58 128.62,31.4 128.82,31.4 129.89,30.32 129.89,30.05 v2(130.28,29.66) 130.28,28.69 130.22,28.62 C48.2 130.22,27.3 129.27,26.34 v2(129.27,25.34) ; 126.42,29.7 X1.2 ; U7.2 133.71,37.28 v2(133.08,37.92) ; C12.1 131.1,29.92 130.85,30.17 130.66,30.17 v2(130.28,30.55) ; 49.45,19.44 49.45,19.63 ; Q5.2 104.5,11.75 v2(103.99,12.26) 103.59,12.26 103.4,12.07 C29.2 102.72,12.01 v2(101.84,12.01) ; C51.2 135.24,31.57 135.21,31.59 135.21,32.51 135.87,32.79 v2(135.87,33.34) ; R37.1 v2(108.95,14.55) ; D20.2 55.55,19.57
  Bottom Layer w0.305: v3(77.71,20.64) 76.82,19.76 74.54,19.76 D18.2 ; C22.2 98.71,62.23 97.92,61.44 96.38,61.44 96.18,61.64 96.18,62.65 95.89,62.95 95.79,63.04 94.67,63.04 94.08,62.45 94.08,62.44 93.87,62.23 C16.2
  Bottom Layer w0.406: 55.55,19.57 54.46,18.49 50.41,18.49 49.45,19.44 ; Q4.2 83.55,19.76 v2(83.67,19.63) ; D20.1 57.44,19.76 v2(57.44,20.72) ; D20.1 D20.2 ; D20.1 57.45,19.57 58.53,18.49 v2(60.56,18.49) ; v2(69.96,15.69) 69.96,14.8 R17.1 ; R34.1 77.92,20.43 v3(77.71,20.64) ; 104.86,64 103.92,64 103.36,63.44 C40.1 101.19,62.68 100.75,62.23 C22.2 ; C45.1 C43.1 C44.1 49.07,19.25 49.45,19.63 ; D18.2 73.66,21.51 73.64,21.52 R32.1 72.58,22.38 72.05,21.85 Q2.2
  Bottom Layer w0.508: 78.09,49.45 77.32,49.45 77.3,49.47 v3(76.56,49.47) 75.67,49.47 D15.2 ; C17.2 49.41,12.79 48.99,12.38 U15.1
  Bottom Layer w0.762: C14.2 64.18,64.08 63.93,63.82 J5.1 61.97,64.44 58.3,64.44 L4.2 58.3,63.21 57.51,62.43 CY2.1 ; 73.28,55.38 C2.2 73.26,55.32 v3(74.4,55.32) 75.96,55.32 76.49,55.85 78.09,55.85 78.09,57.6 78.59,58.11 81.39,58.11 82.02,57.47 v3(82.02,54.93)
  Bottom Layer w1.524: CY2.1 CY3.1
  vias: v2(77.45,7.56) v2(77.45,5.66) v2(79.36,7.56) v2(79.36,5.66) v2(79.36,3.75) v2(79.36,1.85) v2(93.96,11.37) v2(93.96,5.66) v2(93.96,3.75) v2(93.96,1.85) v2(98.41,1.21) v2(100.31,1.21) v2(102.22,1.21) v2(104.12,1.21) v2(106.03,1.21) v2(107.93,1.21) v2(109.84,1.21) v2(111.74,1.21) v2(113.65,1.21) v2(114.92,39.31) v2(114.92,34.87) v2(114.92,26.61) v2(114.92,24.71) v2(114.92,20.26) v2(114.92,18.36) v2(115.55,15.18) v2(116.19,62.81) v2(116.19,61.28) v2(116.44,18.61) v2(116.82,20.26) v2(117.2,56.97) v2(117.2,54.93) v2(117.2,24.71) v2(117.46,52.52) v2(117.46,51.38) v2(117.46,16.45) v2(117.46,15.18) v2(117.84,34.87) v2(117.84,28.26) v2(117.96,1.21) v2(118.09,64.71) v2(118.09,62.81) v2(118.73,14.55) v2(120,64.71) v2(120,62.81) v2(120,53.28) v2(120,45.03) v2(120,1.21) v2(120.63,54.93) v2(121.01,60.01) v2(121.27,34.74) v2(121.9,64.71) v2(121.9,62.81) v2(121.9,56.97) v2(121.9,45.03) v2(122.54,22.17) v2(122.66,60.01) v2(122.79,54.93) v2(122.79,53.28) v2(123.17,58.36) v2(123.17,37.41) v2(123.55,57.09) v2(123.55,40.96) v2(123.68,49.98) v2(123.81,64.71) v2(123.81,62.81) v2(123.81,3.12) v2(123.81,1.21) v2(124.44,31.69) v2(124.95,57.09) v2(125.08,29.79) v2(125.71,64.71) v2(125.71,62.81) v2(125.71,3.12) v2(125.71,1.21) v2(126.09,59) v2(127.62,64.71) v2(127.62,57.09) v2(127.62,55.19) v2(127.62,53.28) v2(127.62,50.87) v2(128.38,34.49) v2(128.76,6.93) v2(128.89,48.84) v2(128.89,46.93) v2(129.52,62.81) v2(129.52,5.02) v2(129.52,3.12) v2(129.52,1.21) v2(129.65,64.71) v2(130.16,34.49) v2(130.16,32.33) v2(130.54,25.98) v2(130.79,28.52) v2(131.43,24.07) v2(131.43,6.93) v2(133.59,22.17) v2(133.84,46.04) v2(134.09,58.49) v2(135.87,64.71) v2(135.87,60.27) v2(135.87,58.36) v2(135.87,46.3) v2(135.87,37.41) v2(135.87,24.07) v2(135.87,22.17) v2(135.87,20.26) v2(135.87,6.93) v2(135.87,1.21) v2(136.02,53.99) v2(136.02,52.01) v2(136,34.74) v2(136,27.88) v2(136,25.6) v2(136.13,30.8)
$$$1112: length 16.4
  Bottom Layer w0.305: R95.1 41.17,20.01 48.47,20.01 50.4,21.94 Q9.3
  Bottom Layer w0.508: Q9.3 50.4,23.31 51.7,24.61 J2.4
$$$1143: length 3
  Bottom Layer w0.406: Q9.1 51.35,19.81 52.11,20.58 52.58,20.58 R96.1
$$$1163: length 5.9
  Bottom Layer w0.406: R99.1 58.25,21.57 57.56,22.26 D20.3
  Bottom Layer w0.508: J2.5 56.5,23.86 D20.3
$$$1347: length 48
  Top Layer w0.762: v3(41.76,53.54) 44.56,53.54 46.59,55.57 46.59,59.91 42,64.5
  Bottom Layer w0.762: v3(41.76,53.54) 41,54.3 35.67,54.3 32.11,50.74 18.02,50.74 16.49,49.22 R104.2
$$$1364: length 5.9
  Bottom Layer w1.016: C13.2 65.16,10.48 65.16,10.86 66.44,12.14 R15.1 R16.2
$$$1652: length 3.7
  Top Layer w0.762: 19.38,1.98 19.38,1.98 D5.1 v3(21.06,1.98)
  Bottom Layer w0.508: 19.29,1.98 R5.1
  Bottom Layer w0.762: v3(21.06,1.98) 19.29,1.98
$$$2054: length 4.2
  Bottom Layer w0.406: R50.2 R49.1 132.53,39.82 132.35,39.82 R44.2
$$$5633: length 17.2
  Bottom Layer w0.305: R89.1 118.6,38.34 118.6,32.84 117.96,32.2 R87.2
  Bottom Layer w0.406: C42.1 120.38,40.95 120.34,40.92 R89.1
  Bottom Layer w0.508: J1.2 116.39,32.25 R87.2
$$$6271: length 10.1
  Top Layer w0.203: v3(54.72,6.04) v3(54.72,7.06) v3(55.73,7.06) ; v3(54.72,6.04) 54.17,6.04 54.14,6.07 T1.7 ; v3(54.72,6.04) v3(55.73,6.04)
  Bottom Layer w0.203: D10.2 54.43,11.53 55.73,10.22 v3(55.73,7.06)
$$$7035: length 4.8
  Bottom Layer w0.406: U7.1 132.76,36.82 131.55,38.03 R44.1 130.71,39.02 130.67,39.06 C50.1
$$$7317: length 7.5
  Bottom Layer w0.508: U2.4 22.53,4.77 23.42,3.88 R8.2
$$$7399: length 3.4
  Top Layer w0.508: 132.19,36.94 132.19,38.04 131.81,38.42 U8.1
$$$7401: length 3.4
  Top Layer w0.508: 134.09,36.94 134.09,38.17 134.35,38.42 U8.3
$$$7548: length 4.4
  Top Layer w0.203: U12.15 v2(120,49.85)
  Bottom Layer w0.406: R80.1 119.11,48.97 v2(120,49.85) 119.99,49.85 119.23,50.61 R78.1
$$$7549: length 4.1
  Top Layer w0.203: v2(121.27,49.85) U12.14
  Bottom Layer w0.406: R81.1 120.89,49.47 v2(121.27,49.85) 121.27,50.83 R79.1
$$$7993: length 5.2
  Top Layer w0.203: v2(127.62,49.85) U12.9
  Bottom Layer w0.203: v2(127.62,49.85) 126.98,49.22 125.8,49.22 125.46,48.88 125.46,48.58 125.24,48.37 R84.1
$$$8346: length 7.7
  Bottom Layer w0.508: D15.1 75.67,46.3 76.16,45.82 R43.2
  Bottom Layer w0.635: U6.1 79.36,47.57 78.34,46.7 R43.2
$$$8373: length 16.8
  Top Layer w0.203: v2(79.36,57.22) 80.4,57.22 85.9,62.72 89.86,62.72 v2(89.9,62.68)
  Bottom Layer w0.203: v2(89.9,62.68) 89.9,62.75
  Bottom Layer w0.305: v2(89.9,62.68) 90.37,62.68 R52.1 ; R45.1 89.9,62.97 89.9,62.75
  Bottom Layer w0.406: U6.4 v2(79.36,57.22)
$$$8545: length 8.7
  Bottom Layer w0.203: R33.2 D19.2
  Bottom Layer w0.406: R34.2 79.96,19.69 80.02,19.69 80.83,20.5 D19.2 81.73,20.5 82,20.77 83.79,20.77 84.62,19.94 Q4.1
$$$8726: length 9.4
  Top Layer w0.254: v2(130.16,41.85) 128.89,40.58 R25.2
  Top Layer w0.406: R25.2 127.96,38.42 127.78,38.42 R26.1
  Bottom Layer w0.406: R49.2 132.1,41.85 v2(130.16,41.85)
$$$9148: length 8.6
  Top Layer w0.508: U8.5 133.08,49.54 133.08,48.94 133.68,48.34 134.98,48.34 135.48,48.84 v1(135.48,49.64)
  Bottom Layer w0.508: R46.1 133.59,51.53 135.48,49.64 v1(135.48,49.64)
$$$9261: length 11.1
  Bottom Layer w0.203: U15.2 U15.4
  Bottom Layer w0.762: D6.2 52.64,15.44 52.29,15.79 C17.1 48.92,15.79 48.25,15.13 U15.4
$$$9324: length 2.6
  Top Layer w0.508: R22.1 134.09,34.61 133.33,33.85 Q1.3
$$$9328: length 5.7
  Top Layer w0.508: R23.2 132.58,25.16 D7.1 132.58,28.57 R47.2 132.66,29.52 132.38,29.8 Q1.1
$$$10461: length 45.2
  Top Layer w0.305: R48.2 125.08,40.08 125.33,40.33 127.87,40.33 130.03,42.49 130.03,57.04 J9.3
  Bottom Layer w0.762: R46.2 130.54,53.22 130.13,53.62 D14.2 130.13,56.94 J9.3 J9.2
$$$12073: length 3.4
  Bottom Layer w0.406: R68.2 99.04,2.26 J4.2
$$$12092: length 3.4
  Bottom Layer w0.406: R69.2 101.07,2.27 J4.3
$$$12104: length 3.4
  Bottom Layer w0.406: R70.2 103.05,5.57 J4.4
$$$12114: length 3.4
  Bottom Layer w0.406: R71.2 105.01,2.29 J4.5
$$$12120: length 3.4
  Bottom Layer w0.406: J4.6 107.04,2.25 R72.2
$$$12123: length 3.4
  Bottom Layer w0.406: J4.7 109.07,2.27 R73.2
$$$12130: length 3.4
  Bottom Layer w0.406: J4.8 111.05,5.55 R74.2
$$$12200: length 4.1
  Bottom Layer w0.406: J4.11 117.05,4.25 R75.2
$$$12208: length 4.2
  Bottom Layer w0.406: J4.12 119.05,4.15 R76.2
$$$12226: length 4.2
  Bottom Layer w0.406: J4.13 121.05,4.06 R77.2
$$$12319: length 67.9
  Top Layer w0.203: v2(114.79,62.55) 112.07,65.27 81.33,65.27 79.53,63.48 79.53,60.7 76.82,57.98 76.82,56.23 74.89,54.3 71.59,54.3 68.58,57.3 L4.1
  Bottom Layer w0.406: R102.1 114.79,61.67 v2(114.79,62.55) 114.79,63.44 R103.2
$$$12325: length 5.6
  Bottom Layer w0.406: U7.3 U7.4 134.6,33.72 134.6,32.62 R28.2
$$$12363: length 28.6
  Bottom Layer w0.305: D19.1 96.12,18.75 99.17,15.71 R35.1
  Bottom Layer w0.406: Q5.3 104.69,14.25 104.1,13.66 C29.1 101.83,13.66 101.79,13.7 R93.1 R35.1
$$$12722: length 2.7
  Bottom Layer w0.762: R104.1 R105.1
$$$12725: length 2.7
  Bottom Layer w0.762: R106.1 R105.2
$$$13023: length 9.3
  Bottom Layer w0.508: U2.3 19.99,5.26 19.03,4.3 18.21,4.3 16.24,2.33 R5.2
  Bottom Layer w0.762: 14.85,2.23 C5.1 ; R5.2 14.85,2.23
$$$13434: length 17.5
  Bottom Layer w0.305: C41.1 120.38,36.19 119.11,34.92 119.11,31.72 116.54,29.15 R87.1
  Bottom Layer w0.406: C41.1 120.34,36.3 R88.2
  Bottom Layer w0.508: R87.1 116.39,29.1 J1.1
$$$16336: length 7.3
  Top Layer w0.508: R24.2 126,34.91 126.35,35.25 U16.2 129.33,35.25 129.33,36.2 128.89,36.65 R25.1
$$$16471: length 15.4
  Top Layer w0.762: CX1.2 5.95,51.44 6.89,51.44 L1.1
  Bottom Layer w0.762: CX1.2 3.79,45.99 2.52,44.72 R1.1
$$$16480: length 25.6
  Bottom Layer w0.762: R2.1 7.6,50.36 3.79,54.17 CX1.1 6.65,56.78 9.05,59.18 L1.4
$$$16618: length 10.3
  Bottom Layer w0.406: R85.2 126.98,48.37 127.62,47.73 127.62,46.04 128.38,45.28 128.38,44.01 129.18,43.21 R27.1 131.5,43.21 131.65,43.06 Q6.1
$$$17793: length 3.4
  Bottom Layer w0.508: 66.4,32.33 R40.1
  Bottom Layer w1.016: v5(63.48,32.33) 66.4,32.33
  vias: v2(46.34,34.23) v2(48.24,34.23) v2(50.15,34.23) v3(64.12,36.14) v3(64.12,34.23) v5(40.62,36.14) v5(40.62,34.23) v5(40.62,32.33) v5(42.53,38.04) v5(42.53,36.14) v5(42.53,34.23) v5(42.53,32.33) v5(44.43,38.04) v5(44.43,36.14) v5(44.43,34.23) v5(44.43,32.33) v5(46.34,32.33) v5(48.24,32.33) v5(50.15,32.33) v5(52.05,38.04) v5(52.05,36.14) v5(52.05,34.23) v5(52.05,32.33) v5(53.96,38.04) v5(53.96,36.14) v5(53.96,34.23) v5(53.96,32.33) v5(55.86,38.04) v5(55.86,36.14) v5(55.86,34.23) v5(55.86,32.33) v5(57.77,38.04) v5(57.77,36.14) v5(57.77,34.23) v5(57.77,32.33) v5(59.67,38.04) v5(59.67,36.14) v5(59.67,34.23) v5(59.67,32.33) v5(61.58,38.04) v5(63.48,38.04)
$$$17797:
  vias: v5(42.53,47.57) v5(42.53,45.66) v5(42.53,43.76) v5(42.53,41.85) v5(44.43,47.57) v5(44.43,45.66) v5(44.43,43.76) v5(44.43,41.85) v5(46.34,47.57) v5(46.34,45.66) v5(48.24,47.57) v5(48.24,45.66) v5(50.15,47.57) v5(50.15,45.66) v5(52.05,47.57) v5(52.05,45.66) v5(52.05,43.76) v5(52.05,41.85) v5(53.96,47.57) v5(53.96,45.66) v5(53.96,43.76) v5(53.96,41.85) v5(55.86,47.57) v5(55.86,45.66) v5(55.86,43.76) v5(55.86,41.85) v5(57.77,47.57) v5(57.77,45.66) v5(57.77,43.76) v5(57.77,41.85) v5(59.67,47.57) v5(59.67,45.66) v5(59.67,43.76) v5(59.67,41.85) v5(61.58,47.57) v5(63.48,47.57) v5(64.12,45.66) v5(64.12,41.85)
$$$18525: length 2.4
  Top Layer w0.508: R65.2 113.98,8.87 113.65,9.2 LED5.1
$$$18527: length 3.1
  Top Layer w0.508: LED4.1 109.71,9.2 108.71,8.19 108.6,8.19 R64.2
$$$19309: length 6.2
  Bottom Layer w0.406: R56.1 R57.2 128.11,38.17 D2.1
  Bottom Layer w0.508: D2.1 128.19,40.02 Q7.1
$$$19372: length 10.3
  Bottom Layer w0.762: R2.2 7.6,32.2 6.44,31.04 6.44,28.57
$$$19375: length 10.4
  Bottom Layer w0.762: R1.2 2.52,32.2 3.94,30.78 3.94,28.57
$$$20020: length 7.1
  Top Layer w0.508: v2(131.81,49.6) U8.6 131.81,52.79 131.81,53.22 C46.1
  Bottom Layer w0.406: R86.1 130.54,48.97 131.17,49.6 v2(131.81,49.6)
$$$20272: length 6.5
  Top Layer w0.203: v2(126.35,49.85) U12.10
  Bottom Layer w0.203: R82.1 123.51,49.22 125.22,49.22 125.86,49.85 v2(126.35,49.85)
  Bottom Layer w0.406: R83.1 v2(126.35,49.85)
$$$20459: length 2.5
  Bottom Layer w0.406: R85.1 126.22,45.94 127.24,44.92 Q7.3
$$$21949: length 45.6
  Top Layer w0.762: F2.2 5.57,44.14 12.68,51.25 12.68,55.44 14.71,57.47 21.09,57.47 23.54,55.03 MOV1.1
  Bottom Layer w0.762: F1.1 31.29,62.68 31.29,60.47 26.02,55.19 MOV1.1
$$$22081: length 5.8
  Top Layer w0.762: T1.5 26.75,2.82 25.91,1.98 D5.2
$$$22503: length 8.4
  Top Layer w0.203: T1.10 55.1,15.82 56.24,16.96 v3(57.51,16.96) v3(57.51,16.07)
  Bottom Layer w0.203: D6.1 59.23,16.07 v3(57.51,16.07)
$$$22728: length 5.4
  Top Layer w0.762: R6.2 R7.2 14.91,4.32 U2.1
$$$22952: length 6
  Bottom Layer w0.508: U1.4 31.37,3.5 30.99,3.88 R8.1 29.39,3.88
  Bottom Layer w0.762: 29.39,3.88 C6.1
$$$22982: length 5.2
  Bottom Layer w0.508: J5.2 64.13,61.82 64.6,62.3 R67.1 R97.1
$$$23262: length 57
  Top Layer w0.203: R107.1 119.82,39.1 116.77,42.15 116.77,54 114.04,56.73 114.04,58.89 110.75,62.17 93.76,62.17 92.79,63.14 85.73,63.14 83.87,61.28 R109.2
$$$23265: length 58.6
  Top Layer w0.203: U12.2 120,43.57 120.56,44.13 120.56,50.77 114.48,56.84 114.48,59.05 110.98,62.55 93.93,62.55 92.95,63.54 85.54,63.54 84.98,62.98 R109.1
  Top Layer w0.406: R108.2 122.28,40.2 121.77,40.71 120.5,40.71 120,41.22 U12.2
$$$23653: length 4.4
  Bottom Layer w0.508: R86.2 133.59,47.72 135.07,46.24 Q6.3
$$$24219: length 18.8
  Top Layer w0.203: v3(57.39,1.72) v3(57.39,2.74) v3(56.37,2.74) ; T1.6 55.06,2.82 55.15,2.74 v3(56.37,2.74) ; v3(56.37,2.74) v3(56.37,1.72)
  Bottom Layer w0.203: 59.11,7.05 D8.2 59.11,4.84 59.07,4.8 D9.2 59.07,1.72 v3(57.39,1.72) ; C13.1 62.24,10.18
  Bottom Layer w1.016: C13.1 62.24,10.18 60.94,8.89 60.94,8.87 59.11,7.05 D8.2
$$$24414: length 2.6
  Top Layer w0.406: R48.1 125.97,38.51 126.27,38.51 R26.2
$$$25465: length 24.9
  Top Layer w0.508: U2.6 26.52,9.32 T1.3
  Bottom Layer w0.203: U2.8 U2.7 U2.6
  Bottom Layer w0.508: U2.6 21.79,14.04 23.35,14.04 24.75,15.44 D4.2
$$$25516: length 2.7
  Bottom Layer w0.762: R3.1 R4.2
$$$25519: length 6.9
  Bottom Layer w0.508: 29.83,12.01 C3.2 29.8,14.1 31.14,15.44 D4.1
  Bottom Layer w0.762: 29.83,12.01 R4.1
$$$26759: length 2.5
  Bottom Layer w1.016: R39.1 R38.2
$$$26761: length 2.5
  Bottom Layer w1.016: R41.1 R40.2
$$$26771: length 10.8
  Bottom Layer w1.016: R39.2 R41.2 71.86,38.3 74.68,35.48 C15.2
$$$26783: length 4.4
  Bottom Layer w1.016: C15.1 77.68,34.73 78.34,35.38 R42.1
$$$26785: length 2.2
  Bottom Layer w1.016: R43.1 R42.2
$$$27745: length 4.4
  Bottom Layer w0.406: Q3.1 68.62,17.85 68.84,18.07 R30.2 70.5,18.87 70.68,18.87 R29.1
$$$27755: length 3.3
  Bottom Layer w0.406: R30.1 69.7,21.12 69.36,21.46 Q2.3
$$$27766: length 6.1
  Bottom Layer w0.406: D18.1 75.41,22.37 R31.1 75.24,22.38 R32.2 72.91,23.98 72.68,23.75 Q2.1
$$$28006: length 4.1
  Bottom Layer w0.406: R36.1 109.9,11.97 109.77,12.1 R37.2 108.02,12.1 107.67,11.75 Q5.1
$$$28651: length 4.4
  Bottom Layer w0.406: C27.2 C28.2 77.05,22.36 R31.2
$$$28729: length 39.2
  Top Layer w0.406: J9.1 116.92,55.82 114.94,57.8 114.94,59.24 111.16,63.02 94.51,63.02 v2(94.09,63.44)
  Bottom Layer w0.305: R51.2 94.51,63.86 v2(94.09,63.44)
  Bottom Layer w0.406: R51.2 R53.2
  Bottom Layer w0.762: J9.1 J9.4
$$$29092: length 2.8
  Bottom Layer w0.406: U9.4 74.02,14.08 R18.1
$$$29133: length 5.4
  Bottom Layer w0.203: 74.02,16.76 73.95,16.83 v2(73.01,16.83) v2(72.24,16.83) v2(72.24,16.2) v2(73.01,16.2)
  Bottom Layer w0.406: C21.2 73.83,17.43 74.02,17.24 U9.6
$$$29142: length 4.4
  Bottom Layer w0.406: U9.3 79.23,14.49 R20.2 79.23,16.42 R19.1
$$$29315: length 3.2
  Bottom Layer w0.406: U9.1 76.82,17.97 76.31,18.49 C21.1
$$$30967: length 12.2
  Top Layer w0.203: U10.44 133.02,19.43 134.6,17.86 134.6,14.29 132.19,11.88 132.19,10.52 R59.1
$$$31753: length 2.9
  Bottom Layer w0.762: D13.1 R148.1
$$$31756: length 2.7
  Bottom Layer w0.762: R149.1 R148.2
$$$31760: length 2.7
  Bottom Layer w0.762: R150.1 R149.2
$$$31764: length 14.8
  Top Layer w0.508: v2(110.73,20.01) 110.73,19.37 109.84,18.49 104.38,18.49 103.33,19.53 U20.1
  Bottom Layer w0.762: v2(110.73,20.01) 109.2,21.53 R150.2
$$$31898: length 103.3
  Top Layer w0.203: v2(107.17,63.7) 106.92,63.94 82.08,63.94 81.08,62.94 81.08,59.91 78.47,57.3 78.47,55.4 73.26,50.19 73.26,25.15 69.45,21.34 49.72,21.34 46.99,24.07 H1.1
  Bottom Layer w0.406: R91.1 R90.1 107.17,63.38 107.18,63.4 107.18,63.7 v2(107.17,63.7)
$$$31899: length 103.7
  Top Layer w0.203: H1.2 49.49,23.06 50.76,21.79 69.08,21.79 72.88,25.58 72.88,50.55 78.07,55.75 78.07,57.65 80.73,60.3 80.73,63.09 81.94,64.3 108.47,64.3 v2(109.07,63.7)
  Bottom Layer w0.406: R90.2 107.97,61.92 108.27,61.92 R92.1 109.07,63.39 109.08,63.39 109.08,63.7 v2(109.07,63.7)
$$$31920: length 7
  Top Layer w0.406: U20.4 105.1,13.13 105.29,13.32 R55.1 107.72,12.52 107.89,12.52 R200.1
$$$32273: length 10.7
  Bottom Layer w0.508: R66.2 R94.1 68.22,55.4 63.8,59.82 J5.3
$$$32678: length 19.5
  Bottom Layer w0.203: R9.1 52.94,3.76 51.93,4.77 50.55,4.77 49.64,5.68 49.64,6.67 49,7.31 46.36,7.31 45.7,6.65 45.7,3.37 45.45,3.12 43.59,3.12 43.03,3.67 R10.2
  Bottom Layer w0.508: R10.2 41.03,3.67 40.86,3.5 U1.1
$$$32682: length 13.8
  Bottom Layer w0.508: U1.2 40.67,2.23 41.23,1.67 R10.1 42.19,1.54 44.46,1.54 C7.1 46.72,1.55 C9.1 46.84,1.53 47.86,2.55 47.86,2.7 48.88,3.71 R11.1 48.88,3.76 48.9,3.79 U3.2
$$$32728: length 19.6
  Bottom Layer w0.203: U3.1 48.68,6.1 47.98,6.8 46.43,6.8 46.16,6.54 46.16,5.06 46.72,4.5 C9.2
  Bottom Layer w0.254: R12.1 54.97,3.71 54,2.74 51.96,2.74 51.03,3.67 50.91,3.67
  Bottom Layer w0.508: U3.1 48.68,5.74 50.76,3.67 50.91,3.67 ; R14.2 52.91,6.06 R13.2 54.97,4.04 R12.1
$$$32733: length 2.1
  Bottom Layer w0.508: R11.2 49.77,1.74 49.98,1.53 50.91,1.53
CF: length 2.5
  Top Layer w0.203: v2(125.08,49.85) U12.11
  Bottom Layer w0.406: v2(125.08,49.85) 124.66,50.27 124.66,50.83 R112.1
IN1: length 6.9
  Top Layer w0.254: v2(122.54,43.38) U12.4
  Bottom Layer w0.305: R88.1 122.92,39.15 122.92,43 v2(122.54,43.38)
IN2: length 30.4
  Top Layer w0.203: v2(116.19,58.36) 119.49,58.36 121.62,56.23 121.62,52.78 122.28,52.11 122.28,50.49 123.17,49.6 123.17,46.47 125.08,44.56 U12.6
  Bottom Layer w0.254: v2(116.19,58.36) 113.16,58.36 110.98,60.54 C39.1
  Bottom Layer w0.406: C39.1 110.98,61.12 R92.2
IP1: length 4.9
  Top Layer w0.254: v2(121.27,43.38) U12.3
  Bottom Layer w0.305: R89.2 121.14,40.88 121.14,43.25 v2(121.27,43.38)
IP2: length 35.3
  Top Layer w0.203: U12.5 123.81,44.56 121.9,46.47 121.9,51.76 121.27,52.39 121.27,56.06 119.48,57.84 116.68,57.84 v2(116.19,57.35)
  Bottom Layer w0.203: v2(116.19,57.35) 113.58,57.35 110.48,60.44 106.55,60.44 105.88,61.12 R91.2
  Bottom Layer w0.406: C40.2 105.26,61.09 R91.2
K1: length 62.1
  Top Layer w0.762: K2.1 69.09,55.1 71.48,52.71 71.48,27.12 68.02,23.66 K1.2
  Bottom Layer w0.508: Q3.3 66.91,22.3 K1.2 ; K1.2 65.58,24 65.27,23.69 63.48,23.69 62.72,22.93 D12.1 ; K1.2 67.62,25.34 71.61,25.34 72.88,26.61 D11.1
K2: length 56
  Top Layer w0.762: K1.1 87.93,23.65 83.21,23.65 78.09,28.77 78.09,47.26 K2.2
  Bottom Layer w0.508: D11.2 81.52,26.61 82.91,25.22 86.37,25.22 K1.1 86.57,22.3 83.67,22.3 Q4.3
L-IN: length 18.5
  Top Layer w0.762: F2.1 16.62,32.49 18.19,30.93
  Bottom Layer w0.508: v5(16.49,34.87) 18.19,34.87 CN2.1
  vias: v5(14.59,32.96) v5(14.59,31.06) v5(14.59,29.15) v5(14.59,27.25) v5(14.59,25.34) v5(16.49,32.96) v5(16.49,29.15) v5(16.49,24.07) v5(18.4,34.87) v5(18.4,24.07) v5(20.3,34.87) v5(20.3,32.96) v5(20.3,29.15) v5(20.3,27.25) v5(20.3,25.34) v5(22.21,34.87) v5(22.21,32.96) v5(22.21,31.06) v5(22.21,29.15) v5(22.21,27.25) v5(22.21,25.34) v5(24.11,34.87) v5(24.11,32.96) v5(24.11,31.06) v5(24.11,29.15) v5(24.11,27.25) v5(24.11,25.34) v5(26.02,34.87) v5(26.02,32.96) v5(26.02,29.15) v5(26.02,27.25) v5(26.02,25.34) v5(27.92,34.87) v5(27.92,29.15) v5(29.83,34.87) v5(29.83,32.96) v5(29.83,29.15) v5(31.73,34.87) v5(31.73,29.15) v5(31.73,27.25) v5(35.54,34.87)
L-IN2: length 41.7
  Top Layer w0.762: v3(38.34,61.28) 34.53,65.09 23.28,65.09 CX2.2
  Bottom Layer w0.762: R106.2 15.48,63.7 16.05,63.12 L1.3 19.85,61.6 CX2.2 ; CY2.2 45.78,61.78 44.91,60.9 38.72,60.9 v3(38.34,61.28) 38.34,63.57 v3(38.21,63.7)
L-OUT: length 10.8
  Top Layer w0.508: U20.2 101.2,21.69 100.27,22.62 CN4.2
  Bottom Layer w0.508: 89.77,34.36 89.73,36.14 v5(88.25,38.04)
  vias: v4(88.25,32.33) v4(90.15,30.42) v4(92.06,36.14) v4(92.06,34.23) v4(92.06,32.33) v4(92.06,30.42) v4(92.06,28.52) v4(93.96,32.33) v4(93.96,30.42) v4(93.96,28.52) v4(95.87,32.33) v4(95.87,30.42) v4(95.87,28.52) v4(97.77,36.14) v4(97.77,34.23) v4(97.77,32.33) v4(97.77,30.42) v4(97.77,28.52) v4(97.77,26.61) v4(97.77,24.71) v4(99.68,32.33) v4(99.68,30.42) v4(99.68,28.52) v4(101.58,32.33) v4(101.58,30.42) v4(101.58,28.52) v4(103.49,34.23) v4(103.49,32.33) v4(103.49,30.42) v4(103.49,28.52) v4(103.49,26.61) v4(103.49,24.71) v5(86.34,38.04) v5(86.34,36.14) v5(86.34,34.23) v5(86.34,32.33) v5(88.25,36.14) v5(88.25,30.42) v5(90.15,38.04) v5(90.15,32.33) v5(90.15,28.52) v5(92.06,38.04) v5(92.06,26.61) v5(93.96,38.04) v5(95.87,38.04) v5(95.87,22.8) v5(97.77,38.04) v5(97.77,22.8) v5(99.68,38.04) v5(99.68,22.8) v5(101.58,38.04) v5(101.58,22.8) v5(103.49,36.14) v5(103.49,22.8) v5(105.39,34.23) v5(105.39,32.33) v5(105.39,30.42) v5(105.39,28.52) v5(105.39,26.61) v5(105.39,24.71)
N-IN: length 12.8
  Top Layer w0.508: CN1.3 29.15,40.62 v5(31.73,38.04)
  Top Layer w0.762: NTC1.1 36.68,52.01 34.65,49.98 34.65,46.79 34.02,46.16 J12.1
  vias: v5(14.59,41.85) v5(14.59,39.95) v5(16.49,43.76) v5(16.49,41.85) v5(16.49,39.95) v5(16.49,38.04) v5(18.4,38.04) v5(19.03,43.12) v5(20.3,38.04) v5(22.21,47.57) v5(22.21,45.66) v5(22.21,43.76) v5(22.21,41.85) v5(22.21,39.95) v5(22.21,38.04) v5(24.11,47.57) v5(24.11,45.66) v5(24.11,43.76) v5(24.11,41.85) v5(24.11,39.95) v5(24.11,38.04) v5(26.02,47.57) v5(26.02,45.66) v5(26.02,43.76) v5(26.02,41.85) v5(26.02,39.95) v5(26.02,38.04) v5(27.92,47.57) v5(27.92,38.04) v5(28.56,43.12) v5(29.83,38.04) v5(31.1,47.57) v5(31.1,43.76) v5(31.73,41.85) v5(31.73,39.95) v5(33.64,41.85) v5(33.64,39.95) v5(33.64,38.04) v5(35.54,41.85) v5(35.54,39.95) v5(35.54,38.04) v5(37.45,47.57) v5(37.45,45.66) v5(37.45,43.76) v5(37.45,41.85) v5(37.45,39.95)
N-IN2: length 38.4
  Top Layer w0.762: CX2.1 31.04,57.98 MOV1.2 32.86,57.01 NTC1.2 39.78,57.01 40.07,57.3 42,57.3
  Bottom Layer w0.762: 42,57.49 42,57.3 42.84,56.46 CY3.2 ; CX2.1 25.13,61.67 21.19,57.73 20.18,57.73 L1.2
